# Altium project RX.PrjPCB
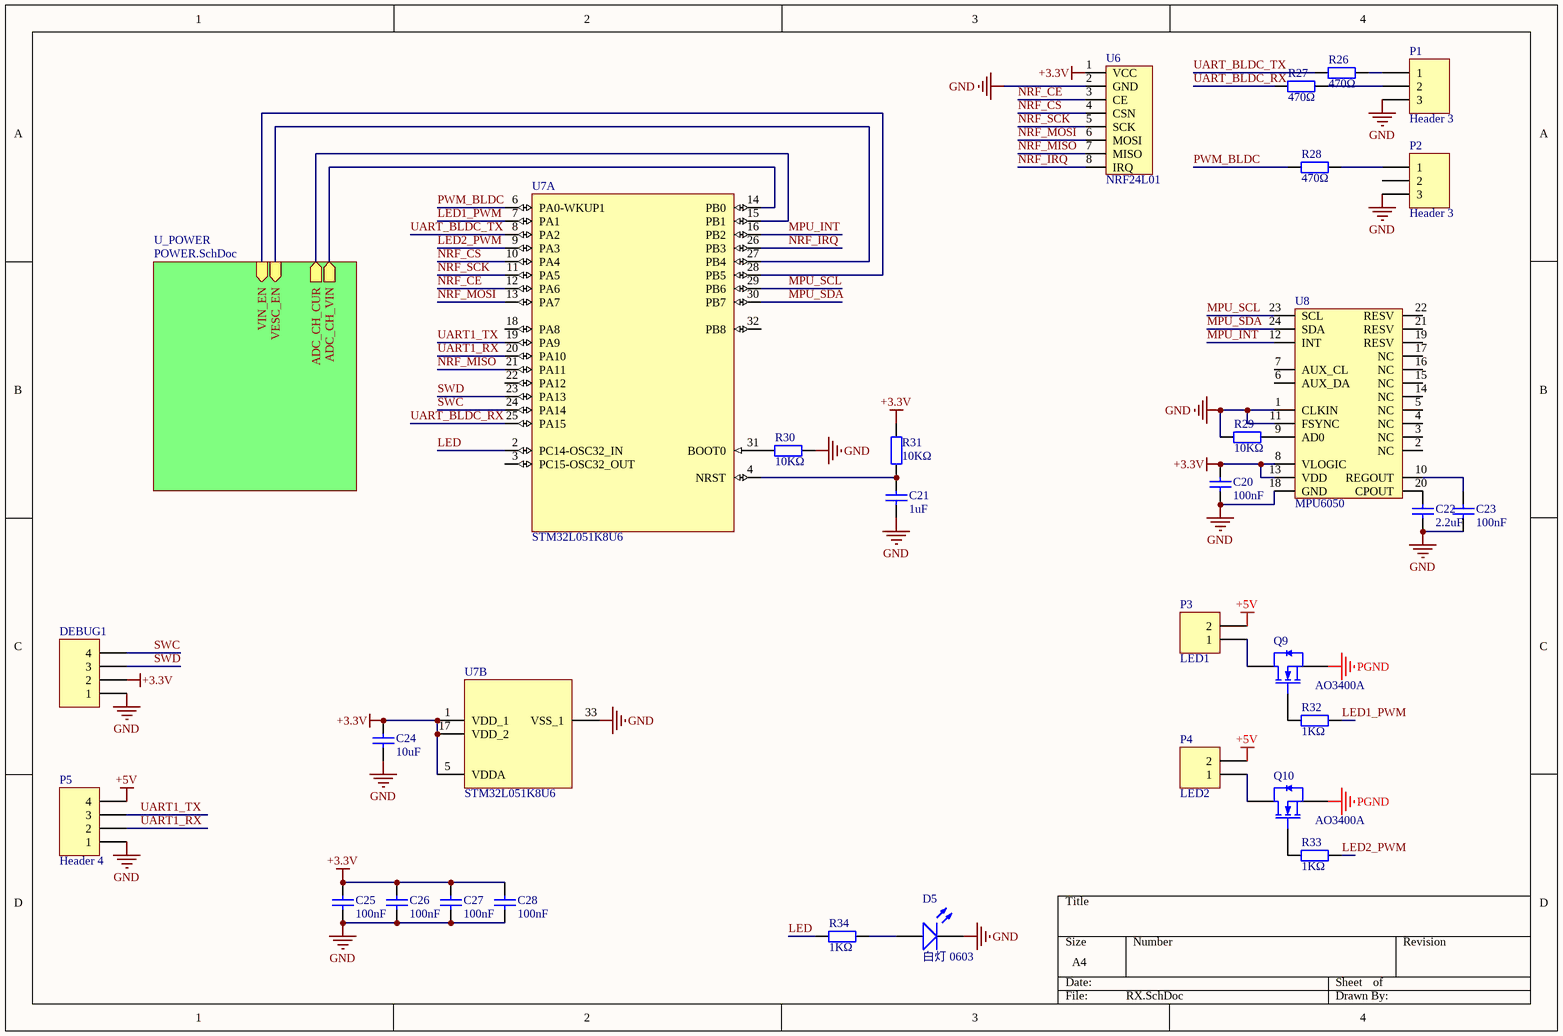
[diagram p0: RX.SchDoc]
2 sheets, 98 parts. Net scope: hierarchical (ports join the sheet entries above them; power ports are global).
Board file: RX_fp.PcbDoc
Sheets:
  RX.SchDoc
    U_POWER = POWER.SchDoc

## Sheet RX.SchDoc
size A4

### Parts
C20  100nF  [0402_C]
C21  1uF  [0402_C]
C22  2.2uF  [0402_C]
C23  100nF  [0402_C]
C24  10uF  [0603_C]
C25  100nF  [0402_C]
C26  100nF  [0402_C]
C27  100nF  [0402_C]
C28  100nF  [0402_C]
D5  白灯 0603  [0603_LED_S1]
DEBUG1  Header 4  [HDR2.54-LI-4P]  (value not drawn)
P1  Header 3  [HDR2.54-LI-3P]
P2  Header 3  [HDR2.54-LI-3P]
P3  LED1  [HDR1X2]
P4  LED2  [HDR1X2]
P5  Header 4  [HDR2.54-LI-4P]
Q9  AO3400A  [SOT-23-3L]
Q10  AO3400A  [SOT-23-3L]
R26  470Ω  [0402_R]
R27  470Ω  [0402_R]
R28  470Ω  [0402_R]
R29  10KΩ  [0402_R]
R30  10KΩ  [0402_R]
R31  10KΩ  [0402_R]
R32  1KΩ  [0402_R]
R33  1KΩ  [0402_R]
R34  1KΩ  [0402_R]
U6  NRF24L01  [miniNRF24L01]
U7  STM32L051K8U6  [UFQFPN32-5x5mm]  (parts A,B of 2)
U8  MPU6050  [QFN-24_4x4x05P]

### Sub-sheets
U_POWER = POWER.SchDoc: ADC_CH_CUR (out), VESC_EN (in), ADC_CH_VIN (out), VIN_EN (in)

### Nets
+3.3V: C20.2 C24.2 C25.2 C26.2 C27.2 C28.2 DEBUG1.2 R31.2 U6.1(VCC) U7.1(VDD_1) U7.5(VDDA) U7.17(VDD_2) U8.8(VLOGIC) U8.13(VDD)
+5V: P3.2 P4.2 P5.4
GND: C20.1 C21.1 C22.1 C23.1 C24.1 C25.1 C26.1 C27.1 C28.1 D5.K DEBUG1.1 P1.3 P2.3 P5.1 R29.1 R30.1 U6.2(GND) U7.33(VSS_1) U8.1(CLKIN) U8.11(FSYNC) U8.18(GND)
PGND: Q9.2(S) Q10.2(S)
LED: R34.1 U7.2(PC14-OSC32_IN)
LED1_PWM: R32.2 U7.7(PA1)
LED2_PWM: R33.2 U7.9(PA3)
MPU_INT: U7.16(PB2) U8.12(INT)
MPU_SCL: U7.29(PB6) U8.23(SCL)
MPU_SDA: U7.30(PB7) U8.24(SDA)
NRF_CE: U6.3(CE) U7.12(PA6)
NRF_CS: U6.4(CSN) U7.10(PA4)
NRF_IRQ: U6.8(IRQ) U7.26(PB3)
NRF_MISO: U6.7(MISO) U7.21(PA11)
NRF_MOSI: U6.6(MOSI) U7.13(PA7)
NRF_SCK: U6.5(SCK) U7.11(PA5)
PWM_BLDC: R28.1 U7.6(PA0-WKUP1)
SWC: DEBUG1.4 U7.24(PA14)
SWD: DEBUG1.3 U7.23(PA13)
UART1_RX: P5.2 U7.20(PA10)
UART1_TX: P5.3 U7.19(PA9)
UART_BLDC_RX: R27.1 U7.25(PA15)
UART_BLDC_TX: R26.1 U7.8(PA2)
NetC6_2: U7.14(PB0) ; sheet U_POWER/ADC_CH_VIN
NetC21_2: C21.2 R31.1 U7.4(NRST)
NetC22_2: C22.2 U8.20(CPOUT)
NetC23_2: C23.2 U8.10(REGOUT)
NetD5_A: D5.A R34.2
NetP1_1: P1.1 R26.2
NetP1_2: P1.2 R27.2
NetP2_1: P2.1 R28.2
NetP3_1: P3.1 Q9.3(D)
NetP4_1: P4.1 Q10.3(D)
NetQ1_1: U7.28(PB5) ; sheet U_POWER/VIN_EN
NetQ9_1: Q9.1(G) R32.1
NetQ10_1: Q10.1(G) R33.1
NetR2_1: U7.15(PB1) ; sheet U_POWER/ADC_CH_CUR
NetR19_1: U7.27(PB4) ; sheet U_POWER/VESC_EN
NetR29_2: R29.2 U8.9(AD0)
NetR30_2: R30.2 U7.31(BOOT0)

Not connected (* = marked no-connect by the designer): P2 2; U7 3(PC15-OSC32_OUT) 18(PA8) 22(PA12) 32(PB8); U8 2(NC) 3(NC) 4(NC) 5(NC) 6(AUX_DA) 7(AUX_CL) 14(NC) 15(NC) 16(NC) 17(NC) 19(RESV) 21(RESV) 22(RESV)

### Library data of the parts
C20 C23 C25-C28 = 0402 100nF (104) 10% 16V: 贴片电容; ComponentLink1Description: 供应商链接; ComponentLink1URL: http://www.szlcsc.com/product/details_1877.html; Package: 0402; Supplier: LC; SuppliersPartNumber: C1525
C21 = 0603 1uF (105) 10% 50V: 贴片电容; ComponentLink1Description: 供应商链接; ComponentLink1URL: http://www.szlcsc.com/product/details_16531.html; Package: 0603; Supplier: LC; SuppliersPartNumber: C15849
C22 C24 = 0603 10uF (106) 10% 10V: 贴片电容; ComponentLink1Description: 供应商链接; ComponentLink1URL: http://www.szlcsc.com/product/details_20411.html; Package: 0603; Supplier: LC; SuppliersPartNumber: C19702
D5 = 0603 白灯: 发光二极管; ComponentLink1Description: 供应商链接; ComponentLink1URL: http://www.szlcsc.com/product/details_2663.html; Package: 0603; Supplier: LC; SuppliersPartNumber: C2290
DEBUG1 P5 = Header 4: Header, 4-Pin; LatestRevisionDate: 17-Jul-2002; LatestRevisionNote: Re-released for DXP Platform.; Publisher: Altium Limited
P1 P2 = Header 3: Header, 3-Pin; LatestRevisionDate: 17-Jul-2002; LatestRevisionNote: Re-released for DXP Platform.; Publisher: Altium Limited
P3 P4 = Header 2: Header, 2-Pin; LatestRevisionDate: 17-Jul-2002; LatestRevisionNote: Re-released for DXP Platform.; Publisher: Altium Limited
Q9 Q10 = AO3400A N道沟 X0YV1T SOT-23: MOS(场效应管); ComponentLink1Description: 供应商链接; ComponentLink1URL: http://www.szlcsc.com/product/details_21629.html; Package: SOT-23; Supplier: LC; SuppliersPartNumber: C20917
R26-R28 = 0402 470Ω (4700) 1%: 贴片电阻; ComponentLink1Description: 供应商链接; ComponentLink1URL: http://www.szlcsc.com/product/details_25860.html; Package: 0402; Supplier: LC; SuppliersPartNumber: C25117
R29-R31 = 0402 10KΩ (1002) 1%: 贴片电阻; ComponentLink1Description: 供应商链接; ComponentLink1URL: http://www.szlcsc.com/product/details_26487.html; Package: 0402; Supplier: LC; SuppliersPartNumber: C25744
R32-R34 = 0402 1KΩ (1001) 1%: 贴片电阻; ComponentLink1Description: 供应商链接; ComponentLink1URL: http://www.szlcsc.com/product/details_12256.html; Package: 0402; Supplier: LC; SuppliersPartNumber: C11702
U7 = STM32L051K8U6: ARM; ComponentLink1Description: 供应商链接; ComponentLink1URL: http://www.szlcsc.com/product/details_10393.html; Package: LQFP-48_7x7x05P; Supplier: LC; SuppliersPartNumber: C9861
U8 = MPU6050: 9轴运动处理传感器

## Sheet POWER.SchDoc
size A4
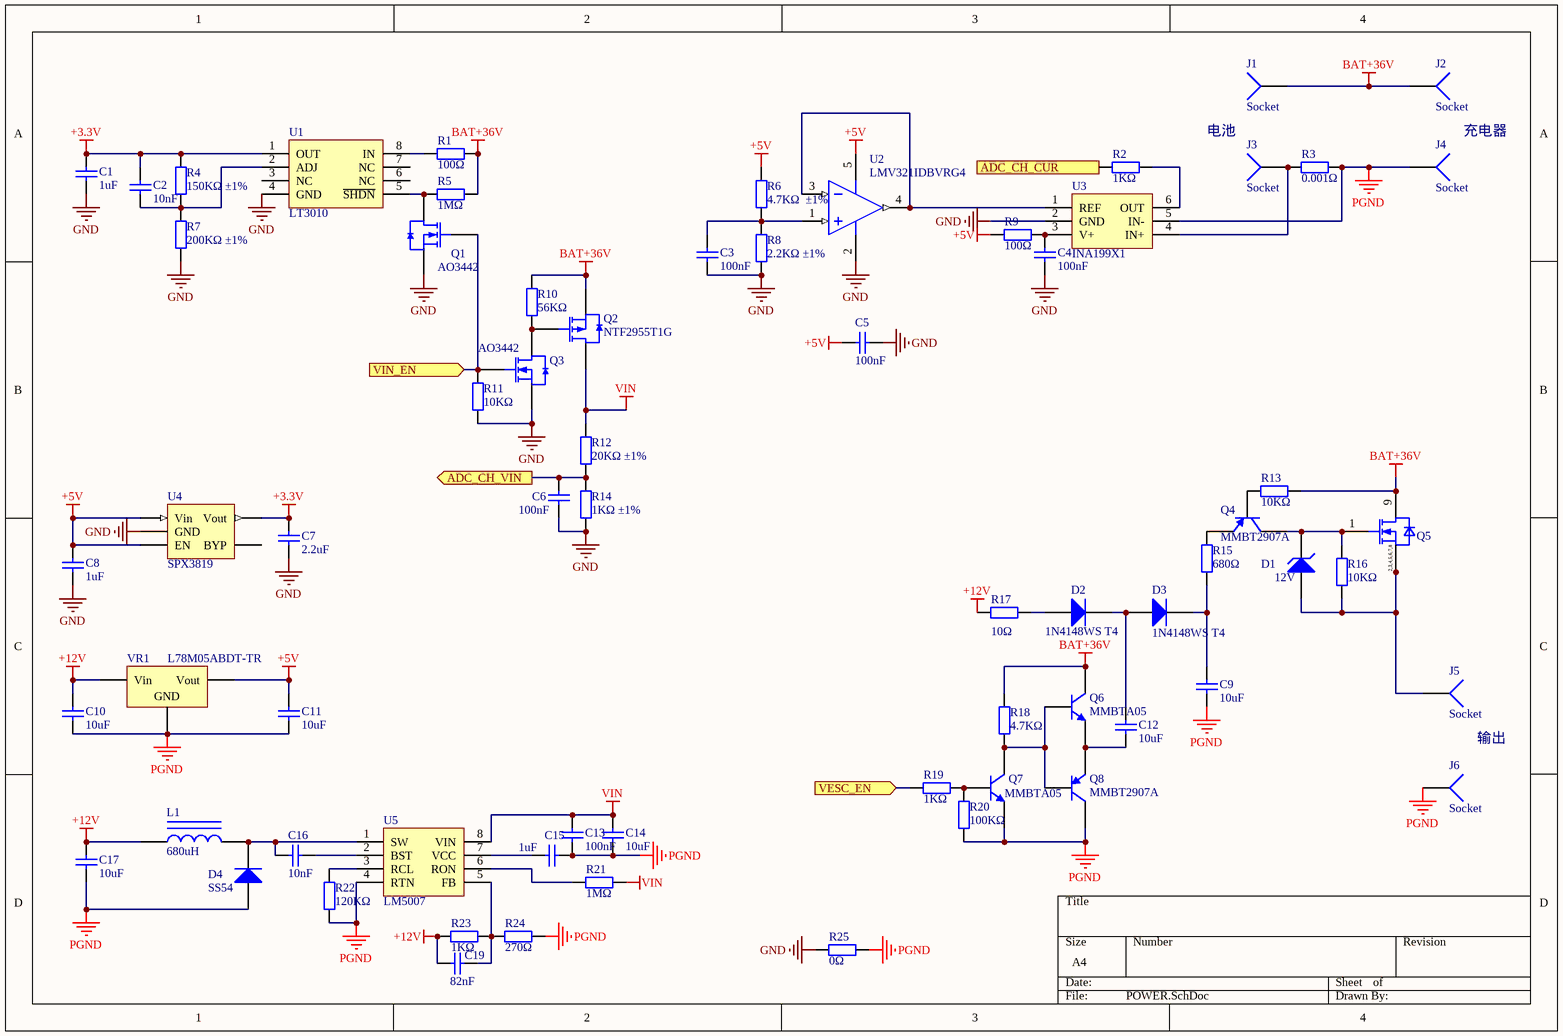
[diagram p1: POWER.SchDoc]

### Parts
C1  1uF  [0603_C]
C2  10nF  [0402_C]
C3  100nF  [0402_C]
C4  100nF  [0402_C]
C5  100nF  [0402_C]
C6  100nF  [0402_C]
C7  2.2uF  [0603_C]
C8  1uF  [0603_C]
C9  10uF  [0805_C]
C10  10uF  [0805_C]
C11  10uF  [0805_C]
C12  10uF  [0805_C]
C13  100nF  [0805_C]
C14  10uF  [1206_C]
C15  1uF  [0402_C]
C16  10nF  [0603_C]
C17  10uF  [1206_C]
C19  82nF  [0402_C]
D1  12V  [LL-34]
D2  1N4148WS T4  [SOD-323]
D3  1N4148WS T4  [SOD-323]
D4  SS54  [SMA(DO-214AC)_S1]
J1  Socket  [PIN1]
J2  Socket  [PIN1]
J3  Socket  [PIN1]
J4  Socket  [PIN1]
J5  Socket  [PIN1]
J6  Socket  [PIN1]
L1  680uH  [CDRH74]
Q1  AO3442  [SOT-23-3L]
Q2  NTF2955T1G  [SOT-223]
Q3  AO3442  [SOT-23-3L]
Q4  MMBT2907A  [SOT-23(SOT-23-3)]
Q5  IPT007N06N  [INF-PG-HSOF-8-1-0]  (value not drawn)
Q6  MMBTA05  [SOT-23(SOT-23-3)]
Q7  MMBTA05  [SOT-23(SOT-23-3)]
Q8  MMBT2907A  [SOT-23(SOT-23-3)]
R1  100Ω  [0402_R]
R2  1KΩ  [0402_R]
R3  0.001Ω  [2512_R]
R4  150KΩ ±1%  [0402_R]
R5  1MΩ  [0402_R]
R6  4.7KΩ  ±1%  [0402_R]
R7  200KΩ ±1%  [0402_R]
R8  2.2KΩ ±1%  [0402_R]
R9  100Ω  [0402_R]
R10  56KΩ  [0402_R]
R11  10KΩ  [0402_R]
R12  20KΩ ±1%  [0402_R]
R13  10KΩ  [0603_R]
R14  1KΩ ±1%  [0402_R]
R15  680Ω  [0603_R]
R16  10KΩ  [0603_R]
R17  10Ω  [0603_R]
R18  4.7KΩ  [0603_R]
R19  1KΩ  [0603_R]
R20  100KΩ  [0603_R]
R21  1MΩ  [0402_R]
R22  120KΩ  [0402_R]
R23  1KΩ  [0402_R]
R24  270Ω  [0402_R]
R25  0Ω  [0603_R]
U1  LT3010  [MSOP-8_EP]
U2  LMV321IDBVRG4  [SOT-23-5]
U3  INA199X1  [DCK0006A_N]
U4  SPX3819  [SOT25-5]
U5  LM5007  [MSOP-8]
VR1  L78M05ABDT-TR  [TO-252-2-180]

### Ports
ADC_CH_CUR (out), ADC_CH_VIN (out), VESC_EN (in), VIN_EN (in)

### Nets
+3.3V: C1.2 C2.2 C7.2 R4.2 U1.1(OUT) U4.5(Vout)
+5V: C5.2 C8.2 C11.2 R6.2 R9.1 U2.5(V+) U4.1(Vin) U4.3(EN) VR1.3(Vout)
+12V: C10.2 C17.1 C19.1 L1.1 R17.2 R23.1 VR1.1(Vin)
BAT+36V: J1.1 J2.1 Q2.3(S) Q5.9(DRAIN) Q6.3(C) R1.2 R5.2 R10.2 R13.1 R18.2
GND: C1.1 C3.1 C4.1 C5.1 C6.1 C7.1 C8.1 Q1.2(S) Q3.2(S) R7.1 R8.1 R11.1 R14.1 R25.1 U1.4(GND) U2.2(V-) U3.2(GND) U4.2(GND)
PGND: C9.1 C10.1 C11.1 C13.1 C14.2 C15.2 C17.2 D4.1(A) J4.1 J6.1 Q7.2(E) Q8.3(C) R3.1 R20.1 R22.1 R24.2 R25.2 U3.5(IN-) U5.4(RTN) VR1.2(GND)
VIN: C13.2 C14.1 Q2.2(D) R12.2 R21.2 U5.8(VIN)
NetC2_1: C2.1 R4.1 R7.2 U1.2(ADJ)
NetC3_2: C3.2 R6.1 R8.2 U2.1(IN+)
NetC4_2: C4.2 R9.2 U3.3(V+)
NetC6_2: C6.2 R12.1 R14.2 ; port ADC_CH_VIN
NetC9_2: C9.2 D3.2(K) R15.2
NetC12_1: C12.1 Q6.2(E) Q8.2(E)
NetC12_2: C12.2 D2.2(K) D3.1(A)
NetC15_1: C15.1 U5.7(VCC)
NetC16_1: C16.1 D4.2(K) L1.2 U5.1(SW)
NetC16_2: C16.2 U5.2(BST)
NetC19_2: C19.2 R23.2 R24.1 U5.5(FB)
NetD1_1: D1.1(A) J5.1 Q5.2(SOURCE) Q5.3(SOURCE) Q5.4(SOURCE) Q5.5(SOURCE) Q5.6(SOURCE) Q5.7(SOURCE) Q5.8(SOURCE) R16.1
NetD1_2: D1.2(K) Q4.3(C) Q5.1(GATE) R16.2
NetD2_1: D2.1(A) R17.1
NetJ3_1: J3.1 R3.2 U3.4(IN+)
NetQ1_1: Q1.1(G) Q3.1(G) R11.2 ; port VIN_EN
NetQ1_3: Q1.3(D) R5.1 U1.5(~{SHDN})
NetQ2_1: Q2.1(G) Q3.3(D) R10.1
NetQ4_1: Q4.1(B) R13.2
NetQ4_2: Q4.2(E) R15.1
NetQ6_1: Q6.1(B) Q7.3(C) Q8.1(B) R18.1
NetQ7_1: Q7.1(B) R19.2 R20.2
NetR1_1: R1.1 U1.8(IN)
NetR2_1: R2.1 ; port ADC_CH_CUR
NetR2_2: R2.2 U3.6(OUT)
NetR19_1: R19.1 ; port VESC_EN
NetR21_1: R21.1 U5.6(RON)
NetR22_2: R22.2 U5.3(RCL)
NetU2_3: U2.3(IN-) U2.4(OUT) U3.1(REF)

Not connected (* = marked no-connect by the designer): U1 3(NC) 6(NC) 7(NC); U4 4(BYP)

### Notes on the sheet
- 电池
- 充电器
- 输出
- (in symbol IPT007N06N) 2,3,4,5,6,7,8

### Library data of the parts
C1 C8 C15 = 0603 1uF (105) 10% 50V: 贴片电容; ComponentLink1Description: 供应商链接; ComponentLink1URL: http://www.szlcsc.com/product/details_16531.html; Package: 0603; Supplier: LC; SuppliersPartNumber: C15849
C2 = 0402 10nF (103) 10% 50V: 贴片电容; ComponentLink1Description: 供应商链接; ComponentLink1URL: http://www.szlcsc.com/product/details_15869.html; Package: 0402; Supplier: LC; SuppliersPartNumber: C15195
C3-C6 = 0402 100nF (104) 10% 16V: 贴片电容; ComponentLink1Description: 供应商链接; ComponentLink1URL: http://www.szlcsc.com/product/details_1877.html; Package: 0402; Supplier: LC; SuppliersPartNumber: C1525
C7 = 0603 2.2uF (225) 10% 16V: 贴片电容; ComponentLink1Description: 供应商链接; ComponentLink1URL: http://www.szlcsc.com/product/details_24366.html; Package: 0603; Supplier: LC; SuppliersPartNumber: C23630
C9-C12 = 0805 10uF (106) 10% 25V: 贴片电容; ComponentLink1Description: 供应商链接; ComponentLink1URL: http://www.szlcsc.com/product/details_16532.html; Package: 0805; Supplier: LC; SuppliersPartNumber: C15850
C13 = 0805 100nF(104) 10% 50V: 贴片电容; ComponentLink1Description: 供应商链接; ComponentLink1URL: http://www.szlcsc.com/product/details_50686.html; Package: 0805; Supplier: LC; SuppliersPartNumber: C49678
C14 C17 = 1206 10uF (106) 10% 50V: 贴片电容; ComponentLink1Description: 供应商链接; ComponentLink1URL: http://www.szlcsc.com/product/details_14236.html; Package: 1206; Supplier: LC; SuppliersPartNumber: C13585
C16 = 0603 10nF (103) 10% 50V: 贴片电容; ComponentLink1Description: 供应商链接; ComponentLink1URL: http://www.szlcsc.com/product/details_58143.html; Package: 0603; Supplier: LC; SuppliersPartNumber: C57112
C19 = 0603 82pF (820) 5% 50V: 贴片电容; ComponentLink1Description: 供应商链接; ComponentLink1URL: http://www.szlcsc.com/product/details_2035.html; Package: 0603; Supplier: LC; SuppliersPartNumber: C1683
D1 = LL-34 ZMM5V6: 稳压二极管; ComponentLink1Description: 供应商链接; ComponentLink1URL: http://www.szlcsc.com/product/details_8541.html; Package: LL-34; Supplier: LC; SuppliersPartNumber: C8062
D2 D3 = SOD-323 1N4148WS T4: 二极管; ComponentLink1Description: 供应商链接; ComponentLink1URL: http://www.szlcsc.com/product/details_2485.html; Package: SOD-323; Supplier: LC; SuppliersPartNumber: C2128
D4 = SMA(DO-214AC) SS54: 二极管; ComponentLink1Description: 供应商链接; ComponentLink1URL: http://www.szlcsc.com/product/details_23178.html; Package: SMA(DO-214AC); Supplier: LC; SuppliersPartNumber: C22452
L1 = 0805 10uH 10%: 贴片电感; ComponentLink1Description: 供应商链接; ComponentLink1URL: http://www.szlcsc.com/product/details_1398.html; Package: 0805; Supplier: LC; SuppliersPartNumber: C1046
Q1 Q3 = AO3400A N道沟 X0YV1T SOT-23: MOS(场效应管); ComponentLink1Description: 供应商链接; ComponentLink1URL: http://www.szlcsc.com/product/details_21629.html; Package: SOT-23; Supplier: LC; SuppliersPartNumber: C20917
Q2 = AO3401A P道沟 X13A15 SOT-23: MOS(场效应管); ComponentLink1Description: 供应商链接; ComponentLink1URL: http://www.szlcsc.com/product/details_15801.html; Package: SOT-23; Supplier: LC; SuppliersPartNumber: C15127
Q4 Q8 = SOT-23 SS8550 Y2: 三极管; ComponentLink1Description: 供应商链接; ComponentLink1URL: http://www.szlcsc.com/product/details_9037.html; Package: SOT-23; Supplier: LC; SuppliersPartNumber: C8542
Q5 = IPT007N06N: OptiMOS N-Channel Power-Transistor; Manufacturer: Infineon Technologies; ManufacturerPartNumber: IPT007N06N; PackageReference: PG-HSOF-8-1
Q6 Q7 = SOT-23 SS8050 Y1: 三极管; ComponentLink1Description: 供应商链接; ComponentLink1URL: http://www.szlcsc.com/product/details_2507.html; Package: SOT-23; Supplier: LC; SuppliersPartNumber: C2150
R1 R9 = 0402 100Ω (1000) 1%: 贴片电阻; ComponentLink1Description: 供应商链接; ComponentLink1URL: http://www.szlcsc.com/product/details_25819.html; Package: 0402; Supplier: LC; SuppliersPartNumber: C25076
R2 R14 R23 = 0402 1KΩ (1001) 1%: 贴片电阻; ComponentLink1Description: 供应商链接; ComponentLink1URL: http://www.szlcsc.com/product/details_12256.html; Package: 0402; Supplier: LC; SuppliersPartNumber: C11702
R3 R25 = 0603 0Ω (0R0) 1%: 贴片电阻; ComponentLink1Description: 供应商链接; ComponentLink1URL: http://www.szlcsc.com/product/details_21903.html; Package: 0603; Supplier: LC; SuppliersPartNumber: C21189
R4 = 0402 150KΩ (1503) 1%: 贴片电阻; ComponentLink1Description: 供应商链接; ComponentLink1URL: http://www.szlcsc.com/product/details_26498.html; Package: 0402; Supplier: LC; SuppliersPartNumber: C25755
R5 R21 = 0402 1MΩ (1004) 1%: 贴片电阻; ComponentLink1Description: 供应商链接; ComponentLink1URL: http://www.szlcsc.com/product/details_26826.html; Package: 0402; Supplier: LC; SuppliersPartNumber: C26083
R6 = 0402 4.7KΩ (4701) 1%: 贴片电阻; ComponentLink1Description: 供应商链接; ComponentLink1URL: http://www.szlcsc.com/product/details_26643.html; Package: 0402; Supplier: LC; SuppliersPartNumber: C25900
R7 = 0402 200KΩ (2003) 1%: 贴片电阻; ComponentLink1Description: 供应商链接; ComponentLink1URL: http://www.szlcsc.com/product/details_26507.html; Package: 0402; Supplier: LC; SuppliersPartNumber: C25764
R8 = 0402 2.2KΩ (2201) 1%: 贴片电阻; ComponentLink1Description: 供应商链接; ComponentLink1URL: http://www.szlcsc.com/product/details_26622.html; Package: 0402; Supplier: LC; SuppliersPartNumber: C25879
R10 = 0402 56KΩ (5602) 1%: 贴片电阻; ComponentLink1Description: 供应商链接; ComponentLink1URL: http://www.szlcsc.com/product/details_26539.html; Package: 0402; Supplier: LC; SuppliersPartNumber: C25796
R11 = 0402 10KΩ (1002) 1%: 贴片电阻; ComponentLink1Description: 供应商链接; ComponentLink1URL: http://www.szlcsc.com/product/details_26487.html; Package: 0402; Supplier: LC; SuppliersPartNumber: C25744
R12 = 0402 20KΩ (2002) 1%: 贴片电阻; ComponentLink1Description: 供应商链接; ComponentLink1URL: http://www.szlcsc.com/product/details_26508.html; Package: 0402; Supplier: LC; SuppliersPartNumber: C25765
R13 R16 = 0603 10KΩ (1002) 1%: 贴片电阻; ComponentLink1Description: 供应商链接; ComponentLink1URL: http://www.szlcsc.com/product/details_26547.html; Package: 0603; Supplier: LC; SuppliersPartNumber: C25804
R15 R17 = 0603 680Ω (6800) 1%: 贴片电阻; ComponentLink1Description: 供应商链接; ComponentLink1URL: http://www.szlcsc.com/product/details_23955.html; Package: 0603; Supplier: LC; SuppliersPartNumber: C23228
R18 = 0603 4.7KΩ (4701) 1%: 贴片电阻; ComponentLink1Description: 供应商链接; ComponentLink1URL: http://www.szlcsc.com/product/details_23889.html; Package: 0603; Supplier: LC; SuppliersPartNumber: C23162
R19 = 0603 1KΩ (1001) 1%: 贴片电阻; ComponentLink1Description: 供应商链接; ComponentLink1URL: http://www.szlcsc.com/product/details_21904.html; Package: 0603; Supplier: LC; SuppliersPartNumber: C21190
R20 = 0603 30KΩ (3002) 1%: 贴片电阻; ComponentLink1Description: 供应商链接; ComponentLink1URL: http://www.szlcsc.com/product/details_23711.html; Package: 0603; Supplier: LC; SuppliersPartNumber: C22984
R22 = 0402 120KΩ (1203) 1%: 贴片电阻; ComponentLink1Description: 供应商链接; ComponentLink1URL: http://www.szlcsc.com/product/details_26493.html; Package: 0402; Supplier: LC; SuppliersPartNumber: C25750
R24 = 0603 270Ω (2700) 1%: 贴片电阻; ComponentLink1Description: 供应商链接; ComponentLink1URL: http://www.szlcsc.com/product/details_23693.html; Package: 0603; Supplier: LC; SuppliersPartNumber: C22966
U1 = LT3010: 50mA、3V 至 80V 低压差微功率稳压器
U2 = LMV321IDBVRG4: 运放; ComponentLink1Description: 供应商链接; ComponentLink1URL: http://www.szlcsc.com/product/details_8449.html; Package: SOT-23-5; Supplier: LC; SuppliersPartNumber: C7972
U5 = LM5007: 降压开关稳压器
VR1 = TO-252-2 L78M05ABDT-TR: 低压差线性稳压(LDO); ComponentLink1Description: 供应商链接; ComponentLink1URL: http://www.szlcsc.com/product/details_59107.html; Package: TO-252-2; Supplier: LC; SuppliersPartNumber: C58069
J1-J6 = Socket: LatestRevisionDate: 17-Jul-2002; LatestRevisionNote: Re-released for DXP Platform.; Publisher: Altium Limited

## Nets that join several sheets
+3.3V: RX (14 pins), POWER (6 pins)
+5V: RX (P3.2 P4.2 P5.4), POWER (9 pins)
GND: RX (21 pins), POWER (18 pins)
PGND: RX (Q9.2 Q10.2), POWER (20 pins)
NetC6_2: RX (U7.14), POWER (C6.2 R12.1 R14.2)
NetQ1_1: RX (U7.28), POWER (Q1.1 Q3.1 R11.2)
NetR2_1: RX (U7.15), POWER (R2.1)
NetR19_1: RX (U7.27), POWER (R19.1)